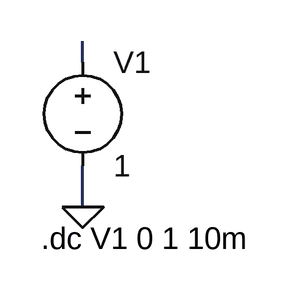
[diagram p0: schematic Func2.asc]
Func2.asc, the LTspice schematic file:
Version 4
SHEET 1 880 680
WIRE 80 112 80 96
WIRE 80 224 80 192
FLAG 80 224 0
SYMBOL voltage 80 96 R0
WINDOW 123 0 0 Left 0
WINDOW 39 0 0 Left 0
SYMATTR InstName V1
SYMATTR Value 1
TEXT 48 248 Left 0 !.dc V1 0 1 10m

The netlist it stands for:
* Func2.asc
V1 N001 0 1
.dc V1 0 1 10m
.backanno
.end